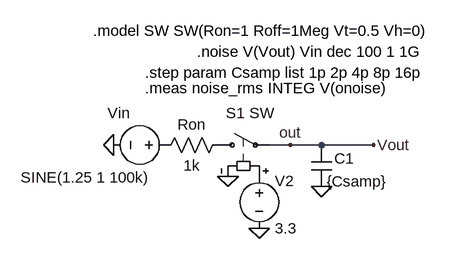
[diagram p0: schematic Draft3.asc]
Draft3.asc, the LTspice schematic file:
Version 4
SHEET 1 1016 768
WIRE 640 400 608 400
WIRE 688 400 640 400
WIRE 768 400 688 400
FLAG 368 400 0
FLAG 544 448 0
FLAG 592 528 0
FLAG 640 400 out
FLAG 768 400 Vout
FLAG 688 464 0
SYMBOL voltage 464 400 R90
WINDOW 0 -34 88 VBottom 2
WINDOW 3 34 140 VTop 2
SYMATTR InstName Vin
SYMATTR Value SINE(1.25 1 100k)
SYMBOL voltage 592 432 R0
WINDOW 0 24 23 Left 2
SYMATTR InstName V2
SYMATTR Value 3.3
SYMBOL res 544 384 R90
WINDOW 0 0 56 VBottom 2
WINDOW 3 32 56 VTop 2
SYMATTR InstName Ron
SYMATTR Value 1k
SYMBOL sw 512 400 R270
WINDOW 0 49 29 VRight 2
WINDOW 3 49 65 VRight 2
SYMATTR InstName S1
SYMBOL cap 672 400 R0
WINDOW 0 36 21 Left 2
SYMATTR InstName C1
SYMATTR Value {Csamp}
TEXT 496 256 Left 2 !.noise V(Vout) Vin dec 100 1 1G
TEXT 336 224 Left 2 !.model SW SW(Ron=1 Roff=1Meg Vt=0.5 Vh=0)
TEXT 416 288 Left 2 !.step param Csamp list 1p 2p 4p 8p 16p
TEXT 416 312 Left 2 !.meas noise_rms INTEG V(onoise)

The netlist it stands for:
* Draft3.asc
Vin P001 0 SINE(1.25 1 100k)
V2 P002 0 3.3
Ron P003 P001 1k
S1 P003 Vout P002 0 SW
C1 Vout 0 {Csamp}
.noise V(Vout) Vin dec 100 1 1G
.model SW SW(Ron=1 Roff=1Meg Vt=0.5 Vh=0)
.step param Csamp list 1p 2p 4p 8p 16p
.meas noise_rms INTEG V(onoise)
.backanno
.end